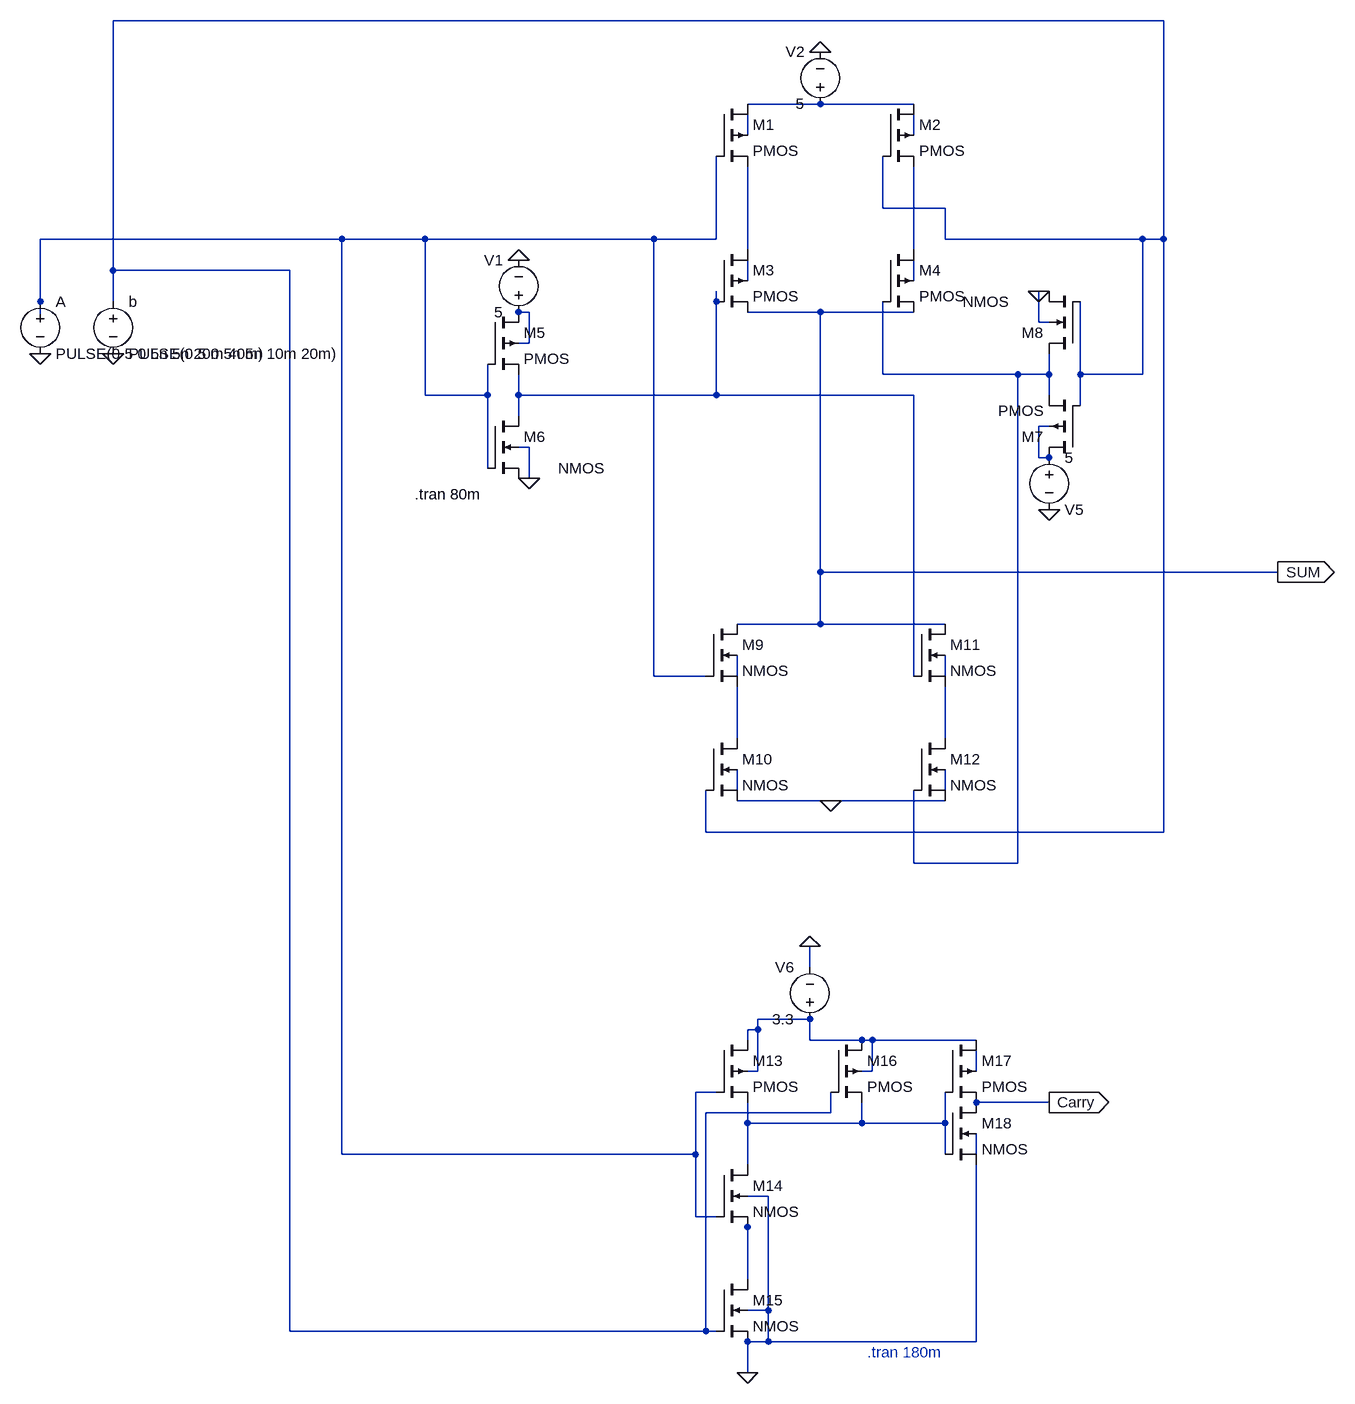
[diagram p0: schematic HALFADDER.asc]
HALFADDER.asc, the LTspice schematic file:
Version 4
SHEET 1 1408 1380
WIRE 1120 -720 -496 -720
WIRE 592 -592 480 -592
WIRE 736 -592 592 -592
WIRE 480 -544 480 -576
WIRE 736 -544 736 -576
WIRE 688 -432 688 -512
WIRE 784 -432 688 -432
WIRE -144 -384 -608 -384
WIRE -16 -384 -144 -384
WIRE 336 -384 -16 -384
WIRE 432 -384 432 -512
WIRE 432 -384 336 -384
WIRE 784 -384 784 -432
WIRE 1088 -384 784 -384
WIRE 1120 -384 1120 -720
WIRE 1120 -384 1088 -384
WIRE 480 -368 480 -496
WIRE 736 -368 736 -496
WIRE -496 -336 -496 -720
WIRE -224 -336 -496 -336
WIRE 480 -320 480 -352
WIRE 736 -320 736 -352
WIRE 944 -304 928 -304
WIRE -608 -288 -608 -384
WIRE -496 -288 -496 -336
WIRE 432 -288 432 -304
WIRE 144 -272 128 -272
WIRE 592 -272 480 -272
WIRE 736 -272 592 -272
WIRE -608 -256 -608 -288
WIRE 928 -256 928 -304
WIRE 944 -256 928 -256
WIRE 144 -224 144 -272
WIRE 144 -224 128 -224
WIRE 688 -176 688 -288
WIRE 896 -176 688 -176
WIRE 944 -176 944 -208
WIRE 944 -176 896 -176
WIRE 992 -176 992 -288
WIRE 1088 -176 1088 -384
WIRE 1088 -176 992 -176
WIRE -16 -144 -16 -384
WIRE 80 -144 80 -192
WIRE 80 -144 -16 -144
WIRE 128 -144 128 -176
WIRE 432 -144 432 -288
WIRE 432 -144 128 -144
WIRE 736 -144 432 -144
WIRE 944 -144 944 -176
WIRE 992 -128 992 -176
WIRE 128 -112 128 -144
WIRE 944 -96 928 -96
WIRE 144 -64 128 -64
WIRE 928 -48 928 -96
WIRE 944 -48 928 -48
WIRE 80 -32 80 -144
WIRE 144 -16 144 -64
WIRE 144 -16 128 -16
WIRE 592 128 592 -272
WIRE 1296 128 592 128
WIRE 592 208 592 128
WIRE 592 208 464 208
WIRE 784 208 592 208
WIRE 336 288 336 -384
WIRE 416 288 336 288
WIRE 464 288 464 256
WIRE 736 288 736 -144
WIRE 784 288 784 256
WIRE 464 384 464 304
WIRE 784 384 784 304
WIRE 464 464 464 432
WIRE 784 464 784 432
WIRE 608 480 464 480
WIRE 784 480 608 480
WIRE 416 528 416 464
WIRE 1120 528 1120 -384
WIRE 1120 528 416 528
WIRE 736 576 736 464
WIRE 896 576 896 -176
WIRE 896 576 736 576
WIRE 576 736 576 704
WIRE 576 816 496 816
WIRE 496 832 496 816
WIRE 496 832 480 832
WIRE 480 848 480 832
WIRE 576 848 576 816
WIRE 656 848 576 848
WIRE 672 848 656 848
WIRE 832 848 672 848
WIRE 496 896 496 832
WIRE 496 896 480 896
WIRE 672 896 672 848
WIRE 672 896 656 896
WIRE 832 896 832 864
WIRE 432 928 400 928
WIRE 944 944 832 944
WIRE 608 960 608 928
WIRE 608 960 416 960
WIRE 480 976 480 944
WIRE 656 976 656 944
WIRE 656 976 480 976
WIRE 784 976 784 928
WIRE 784 976 656 976
WIRE -144 1024 -144 -384
WIRE 400 1024 400 928
WIRE 400 1024 -144 1024
WIRE 784 1024 784 976
WIRE 832 1024 832 992
WIRE 480 1040 480 976
WIRE 512 1088 480 1088
WIRE 400 1120 400 1024
WIRE 432 1120 400 1120
WIRE 480 1136 480 1120
WIRE 480 1216 480 1136
WIRE 512 1264 512 1088
WIRE 512 1264 480 1264
WIRE -224 1296 -224 -336
WIRE 416 1296 416 960
WIRE 416 1296 -224 1296
WIRE 432 1296 416 1296
WIRE 512 1312 512 1264
WIRE 512 1312 480 1312
WIRE 832 1312 832 1040
WIRE 832 1312 512 1312
WIRE 480 1360 480 1312
FLAG 144 -16 0
FLAG 128 -352 0
FLAG 592 -672 0
FLAG 928 -304 0
FLAG 944 32 0
FLAG 1296 128 SUM
IOPIN 1296 128 Out
FLAG 608 480 0
FLAG 480 1360 0
FLAG 576 704 0
FLAG 944 944 Carry
IOPIN 944 944 Out
FLAG -496 -208 0
FLAG -608 -208 0
SYMBOL pmos4 432 -592 R0
SYMATTR InstName M1
SYMBOL pmos4 688 -592 R0
SYMATTR InstName M2
SYMBOL pmos4 432 -368 R0
SYMATTR InstName M3
SYMBOL pmos4 688 -368 R0
SYMATTR InstName M4
SYMBOL pmos4 80 -272 R0
SYMATTR InstName M5
SYMBOL nmos4 80 -112 R0
WINDOW 3 109 80 Left 2
SYMATTR InstName M6
SYMBOL voltage 128 -256 R180
WINDOW 0 24 96 Left 2
WINDOW 3 24 16 Left 2
WINDOW 123 0 0 Left 0
WINDOW 39 0 0 Left 0
SYMATTR InstName V1
SYMATTR Value 5
SYMBOL voltage 592 -576 R180
WINDOW 0 24 96 Left 2
WINDOW 3 24 16 Left 2
WINDOW 123 0 0 Left 0
WINDOW 39 0 0 Left 0
SYMATTR InstName V2
SYMATTR Value 5
SYMBOL pmos4 992 -48 R180
SYMATTR InstName M7
SYMBOL nmos4 992 -208 R180
WINDOW 3 109 80 Left 2
SYMATTR InstName M8
SYMBOL voltage 944 -64 R0
WINDOW 0 24 96 Left 2
WINDOW 3 24 16 Left 2
WINDOW 123 0 0 Left 0
WINDOW 39 0 0 Left 0
SYMATTR InstName V5
SYMATTR Value 5
SYMBOL nmos4 416 208 R0
SYMATTR InstName M9
SYMBOL nmos4 416 384 R0
SYMATTR InstName M10
SYMBOL nmos4 736 208 R0
SYMATTR InstName M11
SYMBOL nmos4 736 384 R0
SYMATTR InstName M12
SYMBOL pmos4 432 848 R0
SYMATTR InstName M13
SYMATTR Value2 l=1040nm w=1040nm
SYMBOL nmos4 432 1040 R0
SYMATTR InstName M14
SYMATTR Value2 l=1040nm w=1040nm
SYMBOL nmos4 432 1216 R0
SYMATTR InstName M15
SYMATTR Value2 l=1040nm w=1040nm
SYMBOL voltage 576 832 R180
WINDOW 0 24 96 Left 2
WINDOW 3 24 16 Left 2
WINDOW 123 0 0 Left 0
WINDOW 39 0 0 Left 0
SYMATTR InstName V6
SYMATTR Value 3.3
SYMBOL pmos4 608 848 R0
SYMATTR InstName M16
SYMBOL pmos4 784 848 R0
SYMATTR InstName M17
SYMBOL nmos4 784 944 R0
SYMATTR InstName M18
SYMBOL voltage -608 -304 R0
WINDOW 123 0 0 Left 0
WINDOW 39 0 0 Left 0
SYMATTR InstName A
SYMATTR Value PULSE(0 5 0 5n 5n 20m 40m)
SYMBOL voltage -496 -304 R0
WINDOW 123 0 0 Left 0
WINDOW 39 0 0 Left 0
SYMATTR InstName b
SYMATTR Value PULSE(0 5 0 5n 5n 10m 20m)
TEXT -32 8 Left 2 !.tran 80m
TEXT 664 1328 Left 2 ;.tran 180m

The netlist it stands for:
* HALFADDER.asc
M1 N002 N005 N006 N003 PMOS
M2 N002 N001 N007 N004 PMOS
M3 N006 N010 SUM N008 PMOS
M4 N007 N012 SUM N009 PMOS
M5 N011 N005 N010 N011 PMOS
M6 N010 N005 0 0 NMOS
V1 N011 0 5
V2 N002 0 5
M7 N013 N001 N012 N013 PMOS
M8 N012 N001 0 0 NMOS
V5 N013 0 5
M9 SUM N005 N016 N014 NMOS
M10 N016 N001 0 N018 NMOS
M11 SUM N010 N017 N015 NMOS
M12 N017 N012 0 N019 NMOS
M13 N020 N005 N022 N020 PMOS l=1040nm w=1040nm
M14 N022 N005 N024 0 NMOS l=1040nm w=1040nm
M15 N024 N001 0 0 NMOS l=1040nm w=1040nm
V6 N020 0 3.3
M16 N020 N001 N022 N020 PMOS
M17 N020 N022 Carry N021 PMOS
M18 Carry N022 0 N023 NMOS
V§A N005 0 PULSE(0 5 0 5n 5n 20m 40m)
V§b N001 0 PULSE(0 5 0 5n 5n 10m 20m)
.model NMOS NMOS
.model PMOS PMOS
.lib standard.mos
.tran 80m
* .tran 180m
.backanno
.end